# EAGLE design Noduino-Falcon (EAGLE 6.6.0)
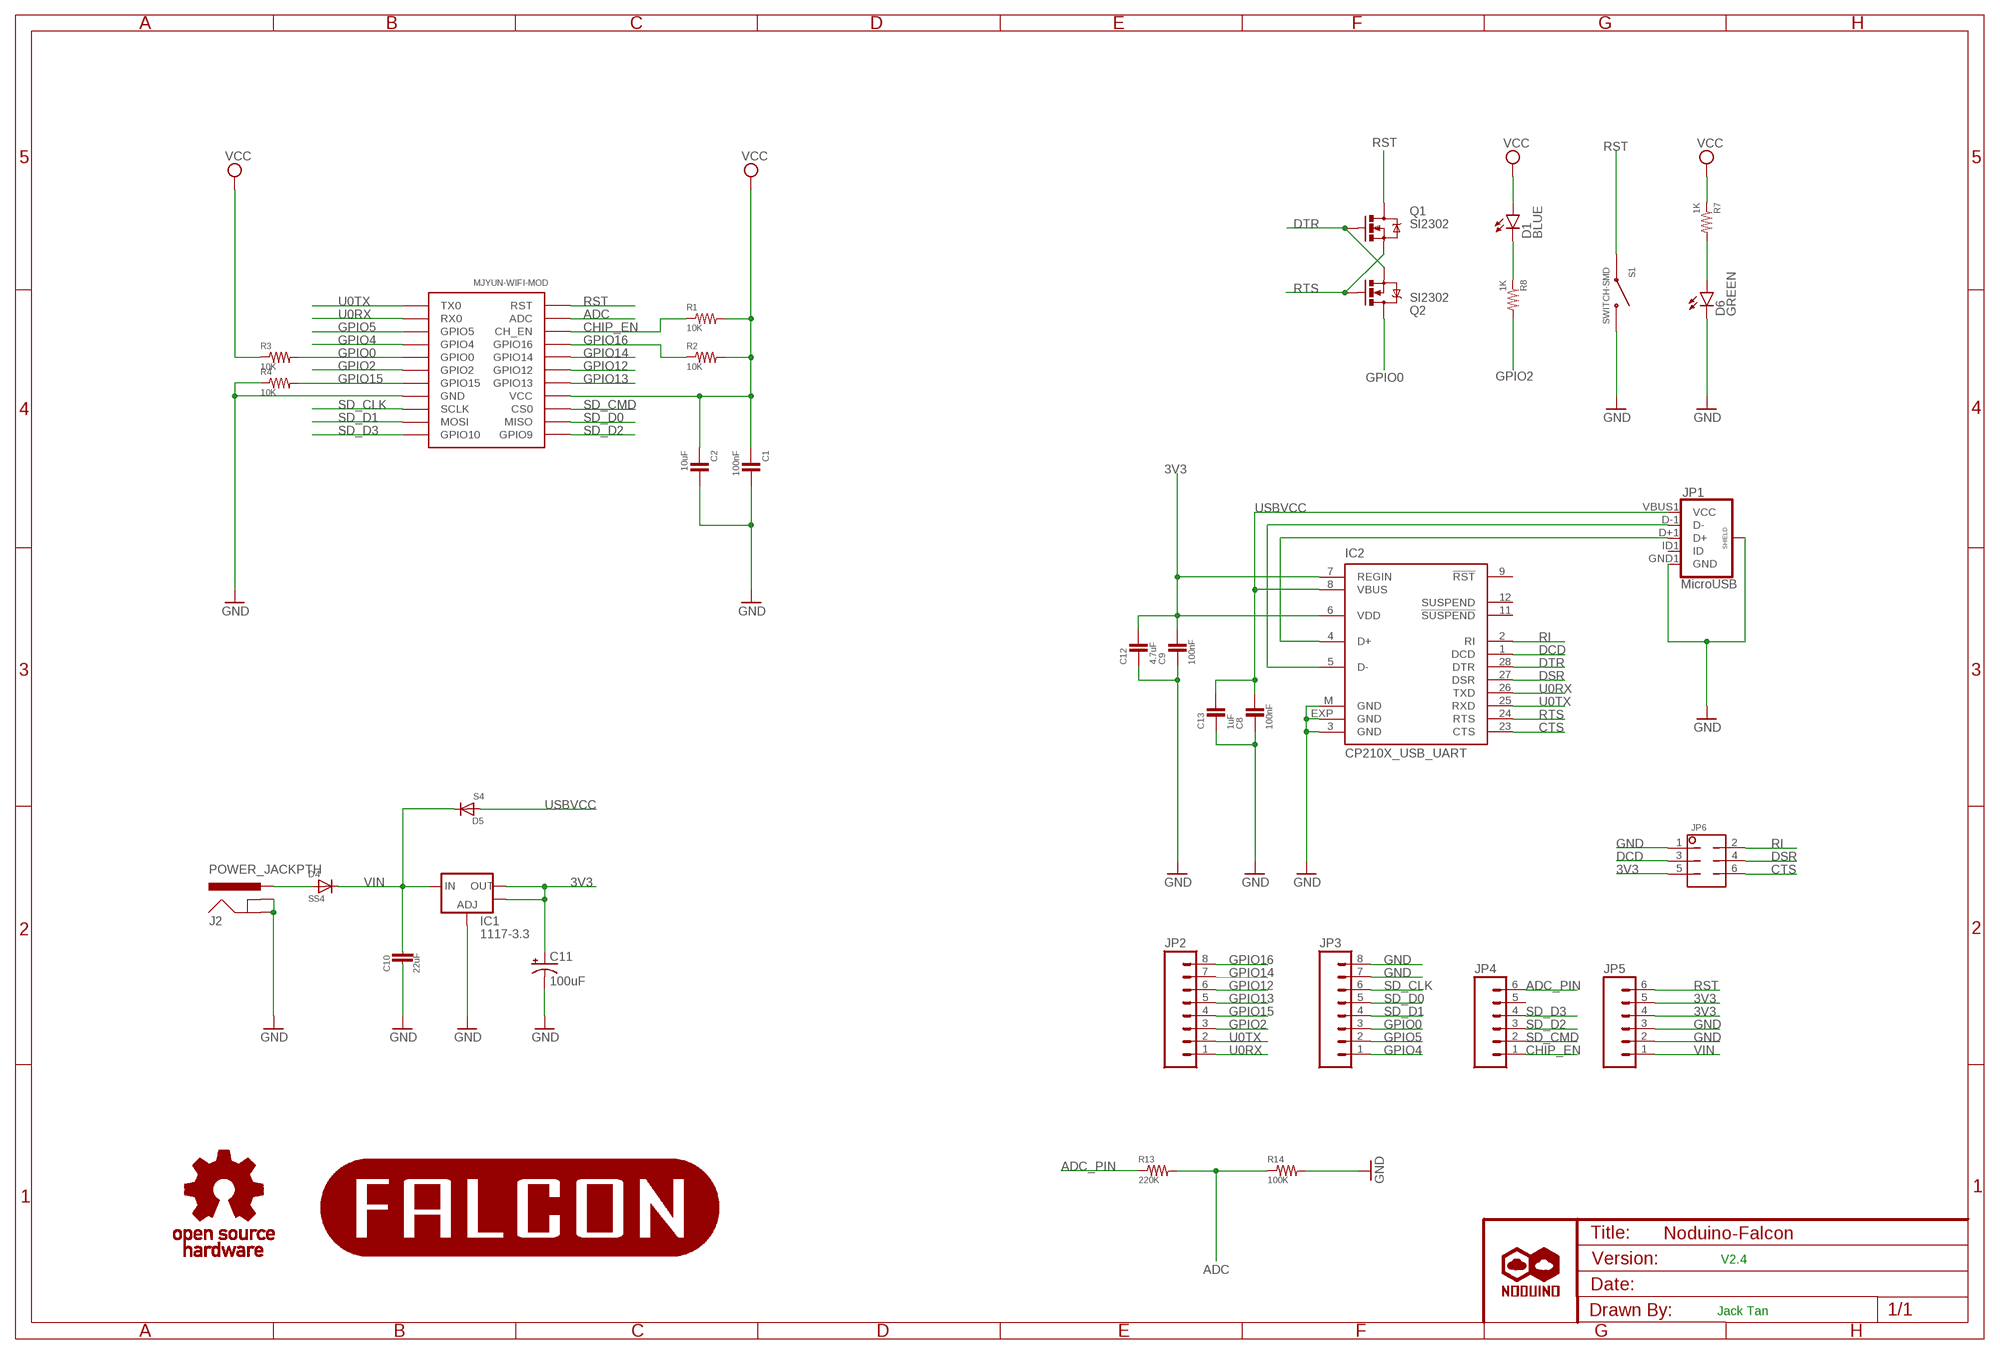
[diagram p0: schematic, sheet 1]

## Parts
C1  100nF  0603-CAP  [0603-CAP]
C2  10uF  0603-CAP  [0603-CAP]
C8  100nF  0603-CAP  [0603-CAP]
C9  100nF  0603-CAP  [0603-CAP]
C10  22uF  CAP-C1206  [C1206]
C11  100uF  CAP_POL3528  [EIA3528]
C12  4.7uF  0603-CAP  [0603-CAP]
C13  1uF  0603-CAP  [0603-CAP]
D1  BLUE  LED-GREEN0603  [LED-0603]
D4  SS4  DIODESMB  [SMB-DIODE]
D5  S4  DIODESOD  [SOD-323]
D6  GREEN  LED-GREEN0603  [LED-0603]
IC1  1117-3.3  AMS1117SOT223  [SOT223]
IC2  CP210X_USB_UART  [MLP28]
J2  POWER_JACKPTH  [POWER_JACK_PTH]
JP1  MicroUSB  USB_MICROB_PLUGCONN-11752  [USB-B-MICRO-SMD_V03]
JP2  M081X08  [1X08]
JP3  M081X08  [1X08]
JP4  M06SIP  [1X06]
JP5  M06SIP  [1X06]
JP6  M02X3  [2X3]
MJYUN-WIFI-MOD  ESP-1212F-DIP-SMD  [ESP-12F-DIP]
Q1  SI2302  -MOSFET-N-SMD  [SOT23-3]
Q2  SI2302  -MOSFET-N-SMD  [SOT23-3]
R1  10K  0603-RESISTOR  [0603-RES]
R2  10K  0603-RESISTOR  [0603-RES]
R3  10K  0603-RESISTOR  [0603-RES]
R4  10K  0603-RESISTOR  [0603-RES]
R7  1K  0603-RESISTOR  [0603-RES]
R8  1K  0603-RESISTOR  [0603-RES]
R13  220K  0603-RESISTOR  [0603-RES]
R14  100K  0603-RESISTOR  [0603-RES]
S1  SWITCH-SMD  [TACTILE-SWITCH-1101NE]
U$1  NODUINO-LOGO-ALL  [NODUINO-ALL-1]
U$2  NODUINO-FALCON  [NODUINO-FALCON]
U$3  OPEN_HARDWARE_LOGO  [OPEN_HARDWARE_LOGO]

## Nets
3V3: C1.1 C2.1 C9.2 C11.A(+) C12.2 D1.A IC1.2(OUT) IC1.4(OUT) IC2.6(VDD) IC2.7(REGIN) JP5.4 JP5.5 JP6.5 MJYUN-WIFI-MOD.P$8(VCC) MJYUN-WIFI-MOD.P$108(VCC) R1.2 R2.2 R3.1 R7.1 ; supply symbol labelled VCC
ADC: MJYUN-WIFI-MOD.P$2(ADC) MJYUN-WIFI-MOD.P$102(ADC) R13.2 R14.1
ADC_PIN: JP4.6 R13.1
CHIP_EN: JP4.1 MJYUN-WIFI-MOD.P$3(CH_EN) MJYUN-WIFI-MOD.P$103(CH_EN) R1.1
CTS: IC2.23(CTS) JP6.6
DCD: IC2.1(DCD) JP6.3
DSR: IC2.27(DSR) JP6.4
DTR: IC2.28(DTR) Q1.1(G) Q2.2(S)
GND: C1.2 C2.2 C8.1 C9.1 C10.2 C11.C(-) C12.1 C13.1 D6.C IC1.1(ADJ) IC2.3(GND) IC2.EXP(GND) IC2.M(GND) J2.GND J2.GNDBREAK JP1.GND1(GND) JP1.SHIELD1(SHIELD) JP1.SHIELD2(SHIELD) JP1.SHIELD3(SHIELD) JP3.7 JP3.8 JP5.2 JP5.3 JP6.1 MJYUN-WIFI-MOD.P$15(GND) MJYUN-WIFI-MOD.P$115(GND) R4.1 R14.2 S1.P$1
GPIO0: JP3.3 MJYUN-WIFI-MOD.P$18(GPIO0) MJYUN-WIFI-MOD.P$118(GPIO0) Q2.3(D) R3.2
GPIO2: JP2.3 MJYUN-WIFI-MOD.P$17(GPIO2) MJYUN-WIFI-MOD.P$117(GPIO2) R8.2
GPIO4: JP3.1 MJYUN-WIFI-MOD.P$19(GPIO4) MJYUN-WIFI-MOD.P$119(GPIO4)
GPIO5: JP3.2 MJYUN-WIFI-MOD.P$20(GPIO5) MJYUN-WIFI-MOD.P$120(GPIO5)
GPIO12: JP2.6 MJYUN-WIFI-MOD.P$6(GPIO12) MJYUN-WIFI-MOD.P$106(GPIO12)
GPIO13: JP2.5 MJYUN-WIFI-MOD.P$7(GPIO13) MJYUN-WIFI-MOD.P$107(GPIO13)
GPIO14: JP2.7 MJYUN-WIFI-MOD.P$5(GPIO14) MJYUN-WIFI-MOD.P$105(GPIO14)
GPIO15: JP2.4 MJYUN-WIFI-MOD.P$16(GPIO15) MJYUN-WIFI-MOD.P$116(GPIO15) R4.2
GPIO16: JP2.8 MJYUN-WIFI-MOD.P$4(GPIO16) MJYUN-WIFI-MOD.P$104(GPIO16) R2.1
N$1: D1.C R8.1
N$5: IC2.4(D+) JP1.D+1(D+)
N$9: IC2.5(D-) JP1.D-1(D-)
N$13: D6.A R7.2
N$16: D4.A J2.PWR
RI: IC2.2(RI) JP6.2
RST: JP5.6 MJYUN-WIFI-MOD.P$1(RST) MJYUN-WIFI-MOD.P$101(RST) Q1.3(D) S1.P$2
RTS: IC2.24(RTS) Q1.2(S) Q2.1(G)
SD_CLK: JP3.6 MJYUN-WIFI-MOD.P$14(SCLK)
SD_CMD: JP4.2 MJYUN-WIFI-MOD.P$9(CS0)
SD_D0: JP3.5 MJYUN-WIFI-MOD.P$10(MISO)
SD_D1: JP3.4 MJYUN-WIFI-MOD.P$13(MOSI)
SD_D2: JP4.3 MJYUN-WIFI-MOD.P$11(GPIO9)
SD_D3: JP4.4 MJYUN-WIFI-MOD.P$12(GPIO10)
U0RX: IC2.26(TXD) JP2.1 MJYUN-WIFI-MOD.P$21(RX0) MJYUN-WIFI-MOD.P$121(RX0)
U0TX: IC2.25(RXD) JP2.2 MJYUN-WIFI-MOD.P$22(TX0) MJYUN-WIFI-MOD.P$122(TX0)
USBVCC: C8.2 C13.2 D5.2(A) IC2.8(VBUS) JP1.VBUS1(VCC)
VIN: C10.1 D4.C D5.1(C) IC1.3(IN) JP5.1
Unconnected: IC2.9(!RST) IC2.11(!SUSPEND) IC2.12(SUSPEND) JP1.ID1(ID) JP4.5

## Notes on the sheet
- V2.4
- Jack Tan

## Library data of the parts
C1 C2 C8 C9 C12 C13 = ehl:0603-CAP
C10 = digital-toy:CAP: Capacitor Standard 0603 ceramic capacitor, and 0.1" leaded capacitor.
C11 = ehl:CAP_POL: Capacitor Polarized These are standard SMD and PTH capacitors. Normally 10uF, 47uF, and 100uF in electrolytic and tantalum varieties. Always verify the external diameter of the through hole cap, it varies with capacity, voltage, and manufacturer. The EIA devices should be standard.
D1 = SparkFun_ESP8266_Thing:LED-GREEN: Various green LEDs Green LEDs used in SFE Production 0603- DIO-00821 LARGE- DIO-00862 LILYPAD- DIO-09910; PROD_ID: DIO-00821; VALUE: GREEN
D4 D5 = ehl:DIODE: Diode These are standard reverse protection diodes and small signal diodes. SMA package can handle up to about 1A. SOD-323 can handle about 200mA. What the SOD-323 package when ordering, there are some mfgs out there that are 5-pin packages.
D6 = SparkFun_ESP8266_Thing:LED-GREEN: Various green LEDs Green LEDs used in SFE Production 0603- DIO-00821 LARGE- DIO-00862 LILYPAD- DIO-09910; PROD_ID: DIO-00821
IC1 = ehl:AMS1117: Voltage Regulator LM1117 Standard adjustable voltage regulator but in SMD form. Spark Fun Electronics SKU : COM-00595
IC2 = ehl:CP210X_USB_UART: Single-Chip USB to UART Bridge Source: www.silabs.com .. CP2101.pdf / cp2102.pdf. Spark Fun Electronics SKU : COM-00310
J2 = ehl:POWER_JACK: Power Jack This is the standard 5.5mm barrel jack for power. The PTH is the most common, proven, reliable, footprint. All others are experimental. The Slot footprint only works if the mill layer is transmitted to the PCB fab house so be warned. Spark Fun Electronics SKU : PRT-00119. Mating wall wart : TOL-00298 (and others)
JP1 = ehl:USB_MICROB_PLUG: USB Micro-B connectors Some male, some female. Watch your step!; PROD_ID: CONN-11752
JP2 JP3 = ehl:M08: Header 8 Standard 8-pin 0.1" header. Use with straight break away headers (SKU : PRT-00116), right angle break away headers (PRT-00553), swiss pins (PRT-00743), machine pins (PRT-00117), and female headers (PRT-00115).
JP4 JP5 = ehl:M06: Header 6 Standard 6-pin 0.1" header. Use with straight break away headers (SKU : PRT-00116), right angle break away headers (PRT-00553), swiss pins (PRT-00743), machine pins (PRT-00117), and female headers (PRT-00115). Molex polarized connector foot print use with SKU : PRT-08094 with associated crimp pins and housings. NOTES ON THE VARIANTS LOCK and LOCK_LONGPADS... This footprint was designed to help hold the alignment of a through-hole component (i.e. 6-pin header) while soldering it into place. You may notice that each hole has been shifted either up or down by 0.005 of an inch from it's more standard position (which is a perfectly straight line). This slight alteration caused the pins (the squares in the middle) to touch the edges of the holes. Because they are alternating, it causes a "brace" to hold the component in place. 0.005 has proven to be the perfect amount of "off-center" position when using our standard breakaway headers. Although looks a little odd when you look at the bare footprint, once you have a header in there, the alteration is very hard to notice. Also, if you push a header all the way into place, it is covered up entirely on the bottom side. This idea of altering the position of holes to aid alignment will be further integrated into the Sparkfun Library for other footprints. It can help hold any component with 3 or more connection pins.
JP6 = ehl:M02X3
MJYUN-WIFI-MOD = ehl:ESP-12
Q1 Q2 = digital-toy:*-MOSFET-N
R1-R4 R7 R8 R13 R14 = ehl:0603-RESISTOR
S1 = ehl:SWITCH-SMD
U$1 = ehl:NODUINO-LOGO-ALL
U$2 = ehl:NODUINO-FALCON
U$3 = ehl:OPEN_HARDWARE_LOGO

## Board
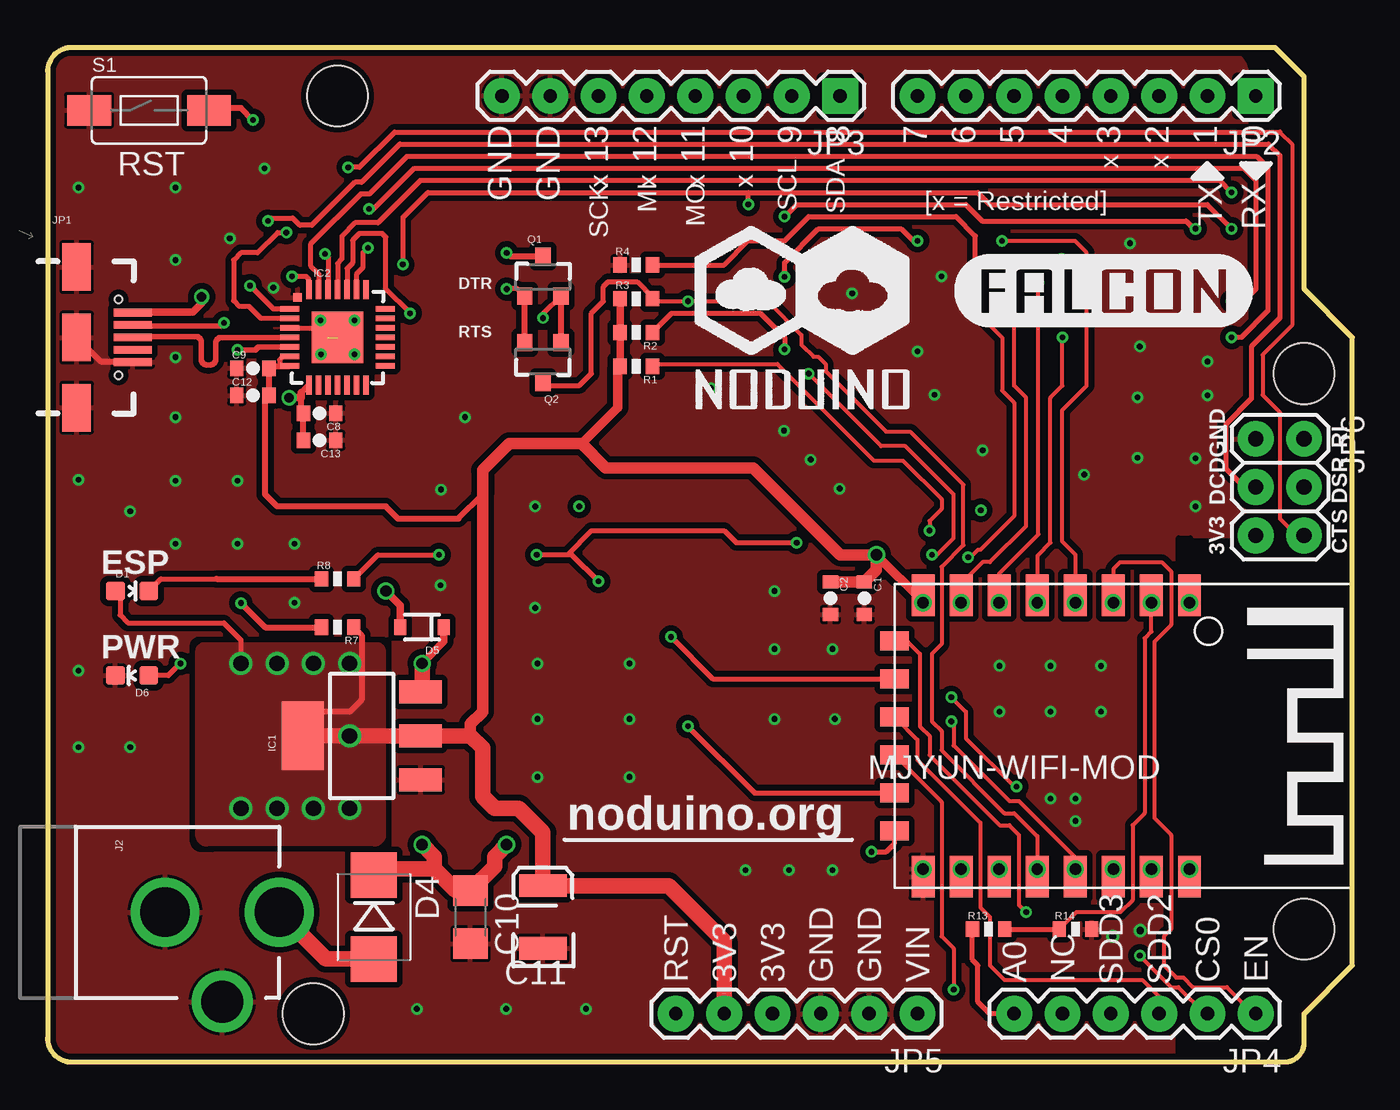
[diagram p1: board, top side]
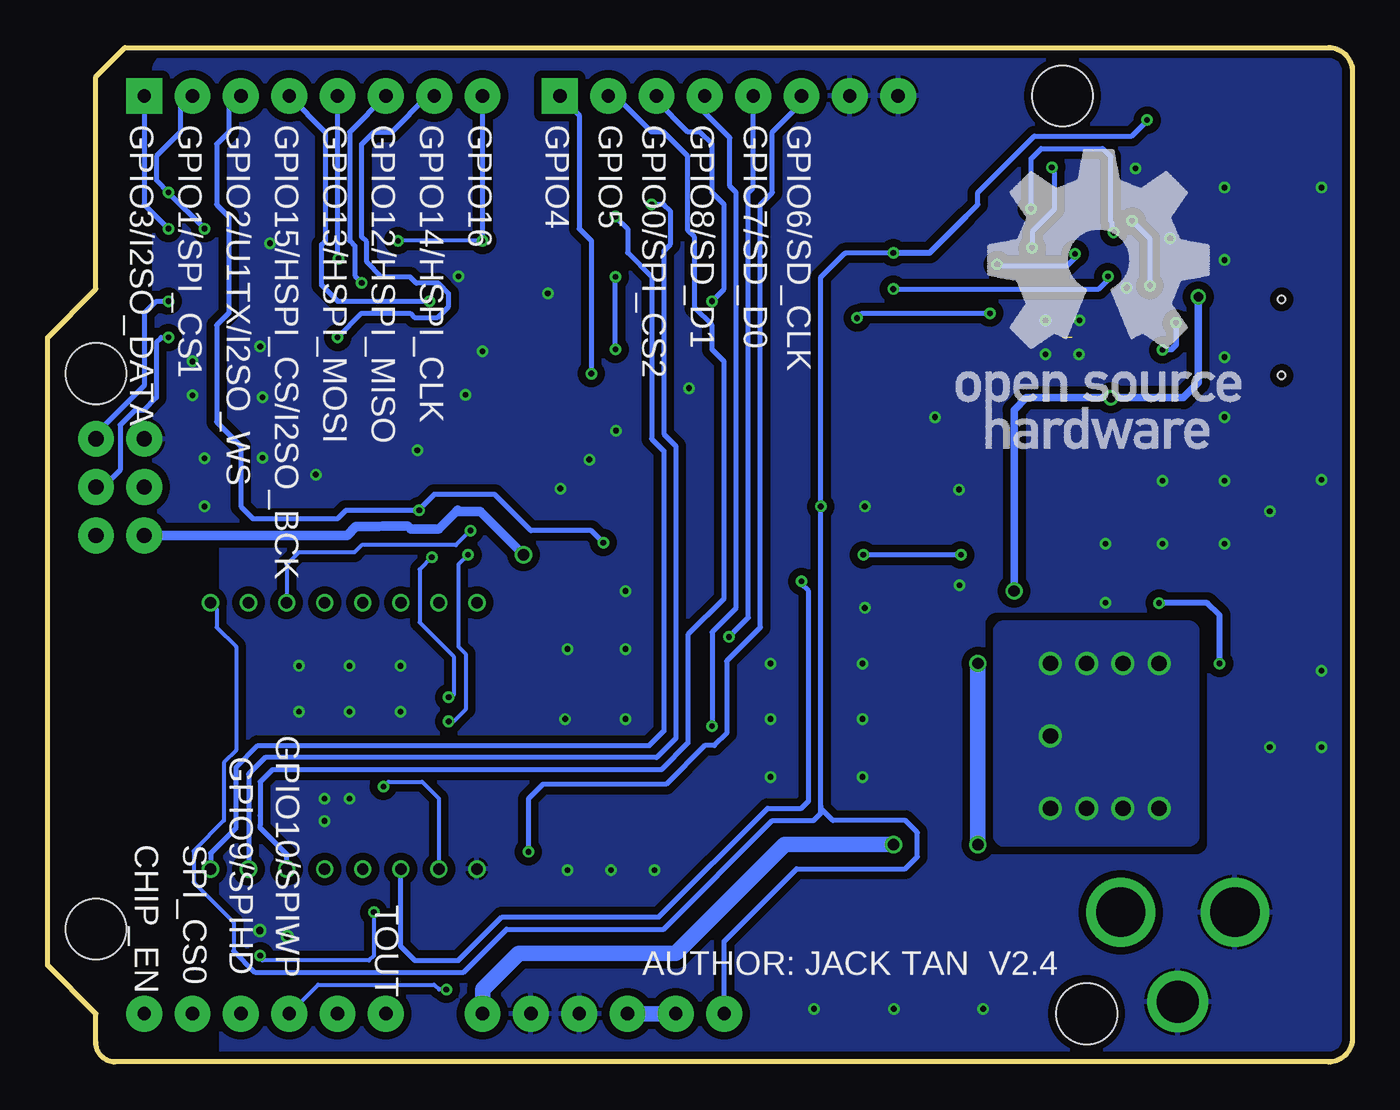
[diagram p2: board, bottom side, seen from below]

Size 68.58 x 53.34 mm. Coordinates in mm from the lower left corner, seen from the top.
Outline: 1.27,0 65.02,0 arc90 66.04,1.02 66.04,2.54 68.58,5.08 68.58,38.1 66.04,40.64 66.04,51.82 64.52,53.34 1.27,53.34 arc90 0,52.07 0,1.27 arc90 1.27,0
Copper layers (1*16): Top 0.035mm / dielectric 1.6mm / Bottom 0.035mm
Design rules "jackslab-micromod *": minimum track width 6mil, minimum drill 0.3mm, track to track 6mil, track to pad 6mil, pad to pad 6mil, via to via 6mil, smd to smd 6mil, copper to edge 6mil, drill to drill 6mil, minimum pad ring 6mil, minimum via ring 6mil, stop-mask expansion 4mil, vias tented up to drill 20mil, thermal gap 6mil
Holes 3.2 mm at 66.04,6.99 66.04,36.2 15.24,50.8 13.97,2.54

### Footprints (pad centres in the part's own frame; a part is rotated, then mirrored left to right if it is on the bottom)
0603-CAP = smd 0.7 x 0.8: 1 -0.85,0; 2 0.85,0
C1206 = smd 1.6 x 1.8: 1 -1.4,0; 2 1.4,0
EIA3528 = smd 1.2 x 2.5: A 1.65,0; C -1.65,0
LED-0603 = smd 1 x 1: A 0,-0.877; C 0,0.877
SMB-DIODE = smd 2.4 x 2.4: A 2.2,0; C -2.2,0
SOD-323 = smd 0.63 x 0.83: 1 -1.15,0; 2 1.15,0
SOT223 = smd 1.219 x 2.235: 1 -2.311,-3.099; 2 0,-3.099; 3 2.311,-3.099 | smd 3.6 x 2.2: 4 0,3.099
MLP28 = smd 1 x 0.3: 1 -2.5,1.5; 2 -2.5,1; 3 -2.5,0.5; 4 -2.5,0; 5 -2.5,-0.5; 6 -2.5,-1; 7 -2.5,-1.5; 15 2.5,-1.5; 16 2.5,-1; 17 2.5,-0.5; 18 2.5,0; 19 2.5,0.5; 20 2.5,1; 21 2.5,1.5 | smd 0.3 x 1: 8 -1.5,-2.5; 9 -1,-2.5; 10 -0.5,-2.5; 11 0,-2.5; 12 0.5,-2.5; 13 1,-2.5; 14 1.5,-2.5; 22 1.5,2.5; 23 1,2.5; 24 0.5,2.5; 25 0,2.5; 26 -0.5,2.5; 27 -1,2.5; 28 -1.5,2.5 | smd 2.7 x 2.7: EXP 0,0 | smd 0.435 x 0.435: M -2.103,2.103
POWER_JACK_PTH = drill 2.6: GND 0,7.7; PWR 0,13.7 | drill 2.2: GNDBREAK 4.7,10.7
USB-B-MICRO-SMD_V03 = smd 2 x 0.4: D+1 2.954,0; D-1 2.954,0.65; GND1 2.954,-1.3; ID1 2.954,-0.65; VBUS1 2.954,1.3 | smd 1.5 x 2.5: SHIELD1 0,3.7; SHIELD2 0,-3.7; SHIELD3 0,0 | hole 0.4: 2.2,2; 2.2,-2
1X08 = drill 0.7 pad 1.88 square: 1 0,0 | drill 0.7 pad 1.88: 2 2.54,0; 3 5.08,0; 4 7.62,0; 5 10.16,0; 6 12.7,0; 7 15.24,0; 8 17.78,0
1X06 = drill 0.7 pad 1.88: 1 0,0; 2 2.54,0; 3 5.08,0; 4 7.62,0; 5 10.16,0; 6 12.7,0
2X3 = drill 0.8 pad 1.88: 1 0,0; 2 0,2.54; 3 2.54,0; 4 2.54,2.54; 5 5.08,0; 6 5.08,2.54
ESP-12F-DIP = drill 0.6: P$1 -3.5,-7; P$2 -1.5,-7; P$3 0.5,-7; P$4 2.5,-7; P$5 4.5,-7; P$6 6.5,-7; P$7 8.5,-7; P$8 10.5,-7; P$15 10.5,7; P$16 8.5,7; P$17 6.5,7; P$18 4.5,7; P$19 2.5,7; P$20 0.5,7; P$21 -1.5,7; P$22 -3.5,7 | smd 1.5 x 1: P$9 12,-5; P$10 12,-3; P$11 12,-1; P$12 12,1; P$13 12,3; P$14 12,5 | smd 1.2 x 2.2: P$101 -3.5,-7.4; P$102 -1.5,-7.4; P$103 0.5,-7.4; P$104 2.5,-7.4; P$105 4.5,-7.4; P$106 6.5,-7.4; P$107 8.5,-7.4; P$108 10.5,-7.4; P$115 10.5,7.4; P$116 8.5,7.4; P$117 6.5,7.4; P$118 4.5,7.4; P$119 2.5,7.4; P$120 0.5,7.4; P$121 -1.5,7.4; P$122 -3.5,7.4
SOT23-3 = smd 0.8 x 0.9: 1 -0.95,-1; 2 0.95,-1; 3 0,1.1
0603-RES = smd 0.7 x 0.8: 1 -0.85,0; 2 0.85,0
TACTILE-SWITCH-1101NE = smd 2.3 x 1.6: P$1 -3.15,0; P$2 3.15,0

### Placement (x,y rotation side)
C1  42.93,24.38 270 top
C2  41.15,24.38 270 top
C8  14.3,34.11 180 top
C9  10.79,36.47 0 top
C10  22.23,7.62 270 top
C11  26.04,7.62 90 top
C12  10.79,35.05 0 top
C13  14.3,32.69 180 top
D1  4.45,24.77 270 top
D4  17.14,7.62 270 top
D5  19.68,22.86 180 top
D6  4.45,20.32 90 top
IC1  16.51,17.14 90 top
IC2  15.24,38.1 0 top
J2  -1.52,7.87 270 top
JP1  1.52,38.1 0 top
JP2  63.5,50.8 180 top
JP3  41.66,50.8 180 top
JP4  63.5,2.54 180 top
JP5  45.72,2.54 180 top
JP6  63.5,32.77 270 top
MJYUN-WIFI-MOD  56.52,17.14 180 top
Q1  26.04,41.27 0 top
Q2  26.04,36.83 180 top
R1  30.94,36.58 180 top
R2  30.94,38.35 180 top
R3  30.94,40.13 0 top
R4  30.94,41.91 0 top
R7  15.24,22.86 180 top
R8  15.24,25.4 0 top
R13  49.45,6.99 0 top
R14  54.03,6.99 0 top
S1  5.33,50.04 0 top
U$1  33.66,33.66 0 top
U$2  47.68,38.64 0 top
U$3  20.82,32.24 0 bottom

### Tracks (layer width: path | path; a pad name or v marks a point on that pad's centre or on a via)
3V3  (via drill 0.6, 0.81)
  Top 0.203: MJYUN-WIFI-MOD.P$8 MJYUN-WIFI-MOD.P$108 | D1.A 3.81,24.52 | 11.43,35.18 11.63,35.38 C12.2
  Top 0.254: 16.51,22.44 R7.1 | 12.19,36.6 IC2.7 | IC2.6 12.37,37.11 12.19,36.93 12.19,36.6 | 3.81,24.52 3.81,23.5 4.22,23.09 9.27,23.09 10.16,22.2 v10.16,20.95 | 12.19,36.58 12.19,36.6
  Top 0.305: IC1.4 13.41,17.22 13.97,17.78 13.34,17.78 13.34,18.41 15.88,18.41 16.51,19.05 16.51,22.44 | 22.86,29.84 21.59,28.57 18.41,28.57 17.78,29.21 12.06,29.21 11.43,29.84 11.43,35.18 | C12.2 C9.2 11.77,36.6 IC2.7
  Top 0.406: R1.2 R2.2 R3.1
  Top 0.508: R1.2 30.1,36.56 29.97,36.44 29.97,34.42 28.07,32.51 | v43.56,26.67 46.02,24.22 MJYUN-WIFI-MOD.P$8
  Top 0.61: 22.23,17.14 22.23,17.78 22.86,18.41 22.86,29.84 22.86,31.11 24.26,32.51 28.07,32.51 29.34,31.24 37.08,31.24 41.66,26.67 v43.56,26.67 43.56,25.87 C1.1 C2.1
  Top 0.813: JP5.5 35.56,6.35 32.64,9.27 C11.A 26.04,12.06 24.77,13.34 23.5,13.34 22.86,13.97 22.86,16.51 22.23,17.14 IC1.2 IC1.4
  Bottom 0.203: 51.16,28.17 51.18,28.14
  Bottom 0.406: 51.16,28.17 50.98,28.19
  Bottom 0.508: 50.98,28.19 49.66,28.19 49.48,28.02 48.03,28.02 47.1,28.94 | 47.1,28.94 47.02,29.03 | 51.18,28.14 52.38,28.14 52.83,27.69 JP6.5 | v43.56,26.67 45.83,28.94 47.1,28.94
  Bottom 0.813: JP5.5 JP5.4
  other vias: 12.06,20.95 13.97,20.95 15.88,20.95 10.16,13.34 12.06,13.34 13.97,13.34 15.88,13.34 15.88,17.14
  pour Bottom (no thermals): 8.13,12.7 8.13,22.61 arc-90 8.64,23.11 17.53,23.11 18.03,23.11 18.29,23.11 arc-90 18.8,22.61 18.8,18.29 18.8,12.19 18.8,11.94 arc-90 18.29,11.43 8.64,11.43 arc-90 8.13,11.94
  pour Top (no thermals): 7.87,12.7 7.87,21.59 arc-90 8.26,21.97 17.14,21.97 17.3,21.97 arc-90 17.68,21.59 17.68,18.82 17.68,15.39 17.68,14.43 17.68,12.83 17.68,11.96 arc-90 17.14,11.43 8.38,11.43 arc-90 7.87,11.94
ADC
  Top 0.203: R14.1 54.06,7.87 56.39,7.87 57.02,8.51 57.02,12.45 57.66,13.08 57.66,22.27 58.02,22.63 MJYUN-WIFI-MOD.P$2 MJYUN-WIFI-MOD.P$102
  Top 0.254: R13.2 R14.1
ADC_PIN
  Top 0.254: JP4.6 49.53,2.54 48.9,3.17 48.9,5.08 48.6,5.38 R13.1
CHIP_EN  (via drill 0.3)
  Top 0.203: MJYUN-WIFI-MOD.P$3 MJYUN-WIFI-MOD.P$103 56.02,25.92 56.39,26.29 58.55,26.29 59.05,25.78 59.05,22.99 58.17,22.1 58.17,12.83 59.05,11.94 59.05,6.99 58.67,6.6 58.67,5.08 59.31,4.45 59.69,4.45 60.2,3.94 61.98,3.94 63.37,2.54 JP4.1 | R1.1 31.91,36.7 38.35,36.7 43.43,31.62 44.96,31.62 46.99,29.59 46.99,29.08 46.35,28.45 v46.35,27.94
  Bottom 0.203: v46.35,27.94 47.12,27.18 52.07,27.18 52.45,26.8 55.37,26.8 56.02,26.15 MJYUN-WIFI-MOD.P$3
CTS  (via drill 0.3)
  Top 0.203: 64.77,48.9 65.41,48.26 65.41,38.73 63.86,37.19 63.86,35.08 64.77,34.16 64.77,28.57 65.66,27.69
  Top 0.254: 64.77,48.9 18.24,48.9 16.38,47.04 v15.8,47.04 | 65.66,27.69 JP6.6 | IC2.23 16.26,40.62 16.26,41.45 16.59,41.78 16.59,42.57 16.82,42.8 v16.84,42.8
  Bottom 0.254: v16.84,42.8 16.79,42.85 16.79,43.69 15.67,44.81 15.67,46.79 v15.8,47.04
DCD  (via drill 0.3)
  Top 0.254: JP6.3 62.89,30.23 61.92,31.19 61.92,33.53 63.27,34.87 63.27,37.62 64.77,39.12 64.77,47.68 64.16,48.26 18.52,48.26 16.51,46.25 16.15,46.25 13.89,43.99 13.26,43.99 12.88,44.37 11.71,44.37 11.58,44.25 v11.58,44.22 | v10.64,40.82 11.86,39.6 IC2.1
  Bottom 0.254: v11.58,44.22 10.64,43.28 v10.64,40.82
DSR  (via drill 0.3)
  Top 0.254: v62.23,38.1 62.74,38.1 64.14,39.5 64.14,47.04 63.55,47.62 18.9,47.62 16.92,45.64 16.46,45.64 13.82,43 13.82,41.88 14.24,41.46 IC2.27
  Bottom 0.254: JP6.4 65.66,30.23 64.77,31.11 64.77,33.5 63.98,34.29 63.5,34.29 62.87,34.92 62.87,37.85 62.61,38.1 v62.23,38.1
DTR  (via drill 0.3)
  Top 0.254: Q1.1 25.07,40.26 24.66,40.66 24.16,40.66 v24.13,40.64 | IC2.28 13.72,40.62 13.72,41.17 13.59,41.3 v12.85,41.3
  Top 0.305: Q2.2 Q1.1
  Bottom 0.254: v24.13,40.64 13.34,40.64 12.85,41.12 v12.85,41.3
GND  (via drill 0.3, 0.38)  (1 unrouted)
  Top 0.254: 14.25,38.58 12.76,38.58 IC2.3
  Top 0.305: JP1.SHIELD3 2.79,36.83 3.81,36.83 3.84,36.8 JP1.GND1 | 14.25,38.58 14.73,38.1 v14.38,37.21
  other vias: 56.9,43.05 60.33,29.21 60.33,31.75 60.96,35.05 60.96,36.83 46.99,41.3 6.73,42.16 6.73,33.91 6.73,37.06 11.4,46.99 12.98,27.25 6.73,27.25 12.98,24.16 20.65,25.07 9.58,43.31 1.63,45.97 6.73,45.97 34.87,35.43 11.86,40.72 50.04,20.83 52.7,20.83 55.37,20.83 50.04,18.41 52.7,18.41 55.37,18.41 52.7,13.84 54.03,12.67 21.95,33.91 20.68,30.1 25.63,29.21 25.63,23.88 25.76,20.95 25.76,18.03 25.76,14.99 28.3,2.79 24.1,2.79 19.41,2.79 1.63,16.56 1.63,20.57 1.63,30.61 4.34,28.96 4.34,16.56 38.2,24.77 38.2,18.03 41.38,18.03 41.25,21.72 38.2,21.72 38.71,33.2 40.11,31.67 41.63,30.15 30.58,20.95 30.58,18.03 30.58,14.99 36.68,10.08 38.96,10.08 41.25,10.08 42.29,40.41 45.72,37.36 46.61,35.08 49.15,32.16 57.4,37.62 57.28,34.95 57.28,31.78 54.48,30.89 57.43,6.91 55.98,6.6 16.13,37.21 16.13,38.99 14.35,38.99 54.03,13.84 9.98,27.25 9.98,30.56 6.73,30.56
  pour Top (isolate 0.406, rank 2): 0.25,51.82 0.25,52.07 arc-90 1.27,53.09 61.98,53.09 arc-90 62.99,52.07 62.99,1.27 arc-90 61.98,0.25 1.27,0.25 arc-90 0.25,1.27
  pour Top (isolate 0.305, rank 2): 0.25,44.7 0.25,52.07 arc-90 1.27,53.09 61.98,53.09 arc-90 62.99,52.07 62.99,1.27 arc-90 61.98,0.25 1.27,0.25 arc-90 0.25,1.27
  pour Bottom (isolate 0.406, rank 2): 61.98,53.09 arc-90 62.99,52.07 62.99,49.28 62.99,1.27 arc-90 61.98,0.25 61.47,0.25 0,0.25 arc-90 -1.02,1.27 -1.02,15.49 -1.02,46.99 -1.02,52.58 arc-90 -0.25,53.09
GPIO0  (via drill 0.3)
  Top 0.203: MJYUN-WIFI-MOD.P$118 MJYUN-WIFI-MOD.P$18 52.02,11.87 50.8,13.08 50.29,13.08 46.99,16.38 46.99,17.4 46.48,17.91 46.48,21.46 46.99,21.97 46.99,26.04 48.13,27.18 48.13,30.35 45.34,33.15 44.07,33.15 40.89,36.32 40.89,36.7 40.51,37.08 40.26,37.08 39.62,37.72 39.62,38.23 37.85,40.01 v33.66,40.01 32,40.01 31.79,40.22
  Top 0.254: Q2.3 26.2,35.56 27.94,35.56 28.57,36.2 28.57,39.37 29.21,40.01 29.21,40.77 29.46,41.02 30.99,41.02 31.79,40.22 R3.2
  Bottom 0.254: v33.66,40.01 33.02,40.64 33.02,45.09 33.66,45.72 33.66,48.26 34.29,48.9 34.92,48.9 36.58,50.55 JP3.3
GPIO2  (via drill 0.3)
  Top 0.203: 49.05,28.96 v49.05,29.01 | MJYUN-WIFI-MOD.P$117 MJYUN-WIFI-MOD.P$17
  Top 0.254: R8.2 17.36,26.67 v20.57,26.67 | v39.37,27.3 36.2,27.3 35.56,27.94 28.57,27.94 27.3,26.67 | 27.3,26.67 v25.7,26.67 | v28.96,25.27 27.56,26.67 27.3,26.67
  Bottom 0.254: v39.37,27.3 40.01,27.94 43.18,27.94 45.09,29.84 48.26,29.84 49.02,29.08 v49.05,29.01 52.91,29.01 53.34,28.57 57.78,28.57 58.42,29.21 58.42,32.38 59.69,33.66 59.69,38.73 59.05,39.37 59.05,44.45 59.69,45.09 59.69,48.26 59.05,48.9 59.05,50.16 JP2.3 | v20.57,26.67 v25.7,26.67 | MJYUN-WIFI-MOD.P$17 50.04,10.12 50.04,6.1 49.28,5.33 46.99,5.33 44.7,7.62 36.45,7.62 30.73,13.34 28.96,13.34 28.57,13.72 28.57,24.77 28.96,25.15 v28.96,25.27
GPIO4  (via drill 0.3)
  Top 0.203: v40.01,36.2 43.81,32.38 45.09,32.38 47.62,29.84 47.62,27.56 46.74,26.67 v46.48,26.67 | MJYUN-WIFI-MOD.P$119 MJYUN-WIFI-MOD.P$19 54.02,10.76 51.05,13.72 50.55,13.72 47.62,16.64 47.62,17.78 v47.5,17.91
  Bottom 0.203: v46.48,26.67 46.99,26.16 46.99,21.84 46.61,21.46 46.61,18.54 47.24,17.91 v47.5,17.91
  Bottom 0.254: JP3.1 40.64,49.78 40.64,43.81 40.01,43.18 v40.01,36.2
GPIO5
  Top 0.203: MJYUN-WIFI-MOD.P$20 MJYUN-WIFI-MOD.P$120
  Bottom 0.254: JP3.2 38.73,50.8 36.83,48.9 36.2,48.9 34.92,47.62 34.92,43.71 34.57,43.36 34.57,39.65 33.66,38.73 33.66,37.47 33.02,36.83 33.02,24.38 34.92,22.48 34.92,16.76 36.32,15.37 56.77,15.37 57.4,14.73 57.4,12.95 57.4,12.45 57.4,12.32 56.01,10.92 56.01,10.15 MJYUN-WIFI-MOD.P$20
GPIO12  (via drill 0.3)
  Top 0.203: v52.07,40.97 52.07,27.74 50.02,25.68 MJYUN-WIFI-MOD.P$106 MJYUN-WIFI-MOD.P$6
  Bottom 0.254: JP2.6 52.7,48.9 52.7,43.18 52.43,42.9 52.43,41.35 52.07,41 v52.07,40.97
GPIO13  (via drill 0.3)
  Top 0.203: v53.29,42.24 51.13,42.24 50.8,41.91 50.8,35.56 51.44,34.92 51.44,28.19 49.53,26.29 49.15,26.29 48.02,25.16 MJYUN-WIFI-MOD.P$107 MJYUN-WIFI-MOD.P$7
  Bottom 0.203: v53.29,42.24 53.34,42.29
  Bottom 0.254: 53.34,42.29 JP2.5
GPIO14  (via drill 0.3)
  Top 0.203: v53.34,38.1 53.34,35.56 52.7,34.92 52.7,27.3 52.02,26.61 MJYUN-WIFI-MOD.P$105 MJYUN-WIFI-MOD.P$5
  Bottom 0.254: v53.34,38.1 52.07,39.37 49.53,39.37 49.3,39.14 48.08,39.14 47.5,39.73 47.5,40.41 48.03,40.95 49.2,40.95 49.53,41.27 51,41.27 51.82,42.09 51.82,43.13 52.07,43.38 52.07,48.26 51.44,48.9 50.49,48.9 48.59,50.8 JP2.7
GPIO15  (via drill 0.3)
  Top 0.203: v48.51,40.01 48.51,39.75 50.16,38.1 50.16,35.31 50.8,34.67 50.8,28.7 49.02,26.92 48.9,26.92 48.51,26.54 v48.39,26.54 | MJYUN-WIFI-MOD.P$16 MJYUN-WIFI-MOD.P$116 | v47.5,19.18 48.26,18.41 48.26,17.02 50.8,14.48 v50.93,14.48
  Top 0.254: R4.2 35.56,41.91 36.83,43.18 38.73,43.18 40.01,44.45 47.75,44.45 48.77,43.43 48.77,40.26 v48.51,40.01
  Bottom 0.203: v48.39,26.54 49.02,25.91 49.02,23.11 47.24,21.34 47.24,19.3 47.37,19.18 v47.5,19.18 | v50.93,14.48 50.67,14.73 48.9,14.73 48.02,13.85 MJYUN-WIFI-MOD.P$16
  Bottom 0.254: v48.51,40.01 53.34,40.01 54.18,40.84 54.18,42.98 53.98,43.18 53.98,48.9 JP2.4
GPIO16  (via drill 0.3)
  Top 0.203: v50.16,43.18 53.98,43.18 54.61,42.55 54.61,35.56 53.34,34.29 53.34,27.36 54.02,26.68 MJYUN-WIFI-MOD.P$104 MJYUN-WIFI-MOD.P$4
  Top 0.254: v38.73,37.47 38.73,38.1 37.47,39.37 32.8,39.37 R2.1 | v38.73,41.27 38.73,42.04 40.51,43.81 44.86,43.81 45.49,43.18 v45.72,43.18
  Bottom 0.203: v45.72,43.18 v50.16,43.18
  Bottom 0.254: v45.72,43.18 JP2.8 | v38.73,37.47 v38.73,41.27
N$1
  Top 0.254: D1.C 5.96,25.4 8.89,25.4
  Top 0.305: 8.89,25.4 R8.1
N$2
  cutout Bottom: 59.69,27.56 65.15,27.56 65.15,-0.76 59.69,-0.76 59.69,27.69
N$3
  cutout Top: 59.82,27.43 64.9,27.43 64.9,-0.33 59.44,-0.33 59.44,27.56 60.07,27.56 60.07,27.43
N$4
  cutout Top: 13.34,40.01 17.14,40.01 17.14,36.2 13.34,36.2
N$5
  Top 0.203: JP1.D+1 4.58,38.2 4.61,38.18
  Top 0.254: 4.61,38.18 4.64,38.15 arc45 4.74,38.1 arc-90 4.79,38.15
  Top 0.279: 4.79,38.15 7.77,38.15 arc-90 8.08,37.85 8.08,36.96 arc90 8.38,36.65 8.53,36.65 arc90 8.84,36.96 8.84,37.8 arc-90 9.14,38.1 IC2.4
N$9  (via drill 0.3)
  Top 0.203: 4.24,38.73 4.34,38.68
  Top 0.279: 4.34,38.68 9.09,38.68 v9.27,38.86 | IC2.5 11.08,37.6 10.92,37.44 v9.98,37.44
  Top 0.305: JP1.D-1 4.24,38.73
  Bottom 0.254: v9.98,37.44 10.06,37.44 10.03,37.47
  Bottom 0.279: 10.03,37.47 9.53,37.47 9.27,37.72 v9.27,38.86
N$13  (via drill 0.3)
  Top 0.254: v6.99,20.95 6.35,20.32 D6.A
  Top 0.305: v10.16,24.13 11.43,22.86 R7.2
  Bottom 0.305: v6.99,20.95 6.99,23.5 7.62,24.13 v10.16,24.13
N$16
  Top 0.813: J2.PWR 14.63,5.42 D4.A
RI  (via drill 0.3)
  Top 0.254: v62.23,40.01 62.87,40.01 63.5,40.64 63.5,46.35 62.87,46.99 19.28,46.99 17.14,44.86 v16.89,44.86 | IC2.2 11.23,39.09 10.59,39.73 10.08,39.73 9.78,40.03 9.78,42.16 10.16,42.55 11.02,42.55 12.09,43.61 v12.55,43.61
  Bottom 0.254: JP6.2 66.04,33.02 63.5,35.56 63.5,39.37 62.87,40.01 v62.23,40.01 | v16.89,44.86 16.84,44.91 16.89,44.96 16.89,47.5 16.36,48.03 13.13,48.03 12.7,47.6 12.7,44.2 12.62,44.12 12.62,43.69 v12.55,43.61
RST  (via drill 0.3)
  Top 0.254: MJYUN-WIFI-MOD.P$1 MJYUN-WIFI-MOD.P$101
  Top 0.305: 26.2,42.55 Q1.3 24.3,42.38 v24.13,42.55 | S1.P$2 8.61,50.16 10.16,50.16 v10.79,49.53
  Bottom 0.203: MJYUN-WIFI-MOD.P$1 59.69,23.82 59.69,22.86 58.67,21.84 58.67,16.38 59.31,15.75 59.31,12.7 60.91,11.1 60.91,9.45 58.8,7.34 58.8,5.84
  Bottom 0.254: JP5.6 33.02,6.35 29.21,10.16 23.5,10.16 22.86,10.79 22.86,12.06 23.5,12.7 27.3,12.7 27.87,13.26 arc45 27.94,13.44 | 27.94,13.44 v27.94,29.21 27.94,41.27 26.74,42.47 arc45 26.57,42.55 23.5,42.55 | 20.32,44.45 19.68,45.09 19.68,45.72 16.71,48.69 11.61,48.69 10.79,49.51 v10.79,49.53 | 27.94,13.44 27.94,13.08 28.32,12.7 30.48,12.7 36.2,6.99 44.45,6.99 46.74,4.7 57.66,4.7 58.8,5.84
  Bottom 0.305: 20.32,44.45 22.23,42.55 23.5,42.55 v24.13,42.55
RTS  (via drill 0.3)
  Top 0.254: Q1.2 26.04,39.33 v26.04,39.12 | v19.05,39.37 17.78,40.64 17.78,43.38 17.6,43.56 16.38,43.56 16.03,43.2 16.03,42.01 15.74,41.72 IC2.24
  Top 0.305: Q2.1 Q1.2
  Bottom 0.254: v26.04,39.12 25.78,39.37 v19.05,39.37
SD_CLK  (via drill 0.3)
  Top 0.254: v43.31,11.05 44.07,11.05 44.52,11.49 MJYUN-WIFI-MOD.P$14
  Bottom 0.254: JP3.6 28.96,50.42 30.48,48.9 30.48,45.72 31.11,45.09 31.11,22.86 32.89,21.08 32.89,17.27 33.53,16.64 34.04,16.64 36.07,14.61 42.55,14.61 43.31,13.84 v43.31,11.05
SD_CMD  (via drill 0.3)
  Top 0.203: MJYUN-WIFI-MOD.P$9 44.56,22.1 45.21,22.1 45.85,21.46 45.85,17.65 46.35,17.14 46.35,16.13 50.04,12.45 50.55,12.45 51.05,11.94 51.05,8.26 v51.44,7.87 | v57.4,5.59 59.05,3.94 59.44,3.94 60.83,2.54 JP4.2
  Bottom 0.203: v51.44,7.87 51.44,5.59 51.69,5.33 57.28,5.33 57.4,5.46 v57.4,5.59
SD_D0  (via drill 0.3)
  Top 0.254: v32.77,22.35 34.97,20.14 MJYUN-WIFI-MOD.P$10
  Bottom 0.203: 31.5,50.55 JP3.5
  Bottom 0.254: JP3.5 31.5,45.97 31.75,45.72 31.75,23.37 v32.77,22.35
SD_D1  (via drill 0.3)
  Top 0.254: v33.66,17.65 37.16,14.14 MJYUN-WIFI-MOD.P$13
  Bottom 0.254: JP3.4 34.04,49.91 32.72,48.59 32.72,46.05 32.38,45.72 32.38,23.88 33.66,22.61 v33.66,17.65
SD_D2
  Top 0.203: MJYUN-WIFI-MOD.P$11 45.72,16.94 45.72,15.88 49.02,12.57 49.02,11.81 49.02,11.3 49.02,8.13 49.53,7.62 49.53,5.08 50.29,4.32 57.53,4.32 58.42,3.43 JP4.3
SD_D3  (via drill 0.3)
  Top 0.203: MJYUN-WIFI-MOD.P$12 46.99,13.67 46.99,6.6 47.62,5.97 v47.62,3.81
  Bottom 0.203: JP4.4 54.36,4.06 48.26,4.06 48.01,3.81 v47.62,3.81
U0RX  (via drill 0.3)
  Top 0.203: MJYUN-WIFI-MOD.P$21 MJYUN-WIFI-MOD.P$121
  Top 0.254: 36.83,45.72 19.99,45.72 18.67,44.4 v18.67,41.94 | 36.83,45.72 48.9,45.72 49.53,45.09 60.96,45.09 v62.23,43.81 | v36.83,45.09 36.83,45.72 | v14.58,42.49 14.74,42.33 IC2.26
  Bottom 0.254: JP2.1 63.5,45.09 v62.23,43.81 | v36.83,45.09 36.2,45.09 35.87,44.76 35.87,42.98 36.2,42.65 36.2,33.02 35.56,32.38 35.56,17.02 36.58,16 57.15,16 58.02,15.14 MJYUN-WIFI-MOD.P$21 | v18.67,41.94 18.62,41.88 14.99,41.88 14.58,42.29 v14.58,42.49
U0TX  (via drill 0.3)
  Top 0.203: MJYUN-WIFI-MOD.P$22 MJYUN-WIFI-MOD.P$122
  Top 0.254: v62.23,45.72 61.59,46.35 19.61,46.35 17.37,44.12 16.15,44.12 15.47,43.43 15.47,42.22 15.24,41.99 IC2.25 | v38.73,44.45 39.37,45.09 48.26,45.09 49.12,44.22 59.84,44.22 60.25,43.81 v60.33,43.81
  Bottom 0.254: JP2.2 61.59,50.16 61.59,48.9 62.87,47.62 62.87,46.35 v62.23,45.72 v60.33,43.81 | v38.73,44.45 38.1,43.81 38.1,42.55 36.83,41.27 36.83,32.77 36.2,32.13 36.2,17.4 36.96,16.64 57.53,16.64 58.67,15.49 58.67,12.32 60.02,10.98 MJYUN-WIFI-MOD.P$22
USBVCC  (via drill 0.5, 0.6)
  Top 0.254: JP1.VBUS1 4.25,39.42
  Top 0.305: IC2.8 13.34,35.2 | C13.2 C8.2 13.34,34.23 13.34,34.92
  Top 0.406: 4.25,39.42 7.62,39.42 8.1,39.9 v8.1,40.23 | v17.78,24.77 18.54,24.01 D5.2 | v12.7,34.92 13.34,34.92 13.34,35.2
  Bottom 0.406: v17.78,24.77 17.78,34.29 17.14,34.92 v12.7,34.92 8.89,34.92 8.1,35.71 v8.1,40.23
VIN  (via drill 0.6, 0.61)
  Top 0.406: v19.68,20.95 20.84,22.11 D5.1
  Top 0.813: IC1.3 19.68,19.53 v19.68,20.95 | D4.C 17.48,10.16 20.32,10.16 | 20.32,10.16 21.46,9.02 C10.1 23.5,10.29 23.5,10.79 v24.13,11.43 | v19.68,11.43 20.32,10.79 20.32,10.16
  Bottom 0.813: v24.13,11.43 29.84,11.43 35.56,5.71 43.81,5.71 45.72,3.81 JP5.1 | v19.68,20.95 v19.68,11.43

### Text on the board
tPlace: GND | GND | 13 | 12 | 11 | 10 | 9 | 8 | 7 | 6 | 5 | 4 | 3 | 2 | 1 | 0 | RST | SCL | SDA | x | x | SCK | x | MI | x | MO | x | x | TX | RX | [x = Restricted] | DTR | RTS | GND | RI | DCD | DSR | 3V3 | CTS | ESP | PWR | noduino.org | RST | 3V3 | 3V3 | GND | GND | VIN | A0 | NC | SDD3 | SDD2 | CS0 | EN
bPlace: GPIO6/SD_CLK | GPIO7/SD_D0 | GPIO8/SD_D1 | GPIO0/SPI_CS2 | GPIO5 | GPIO4 | GPIO16 | GPIO14/HSPI_CLK | GPIO12/HSPI_MISO | GPIO13/HSPI_MOSI | GPIO15/HSPI_CS/I2SO_BCK | GPIO2/U1TX/I2SO_WS | GPIO1/SPI_CS1 | GPIO3/I2SO_DATA | GPIO10/SPIWP | GPIO9/SPIHD | SPI_CS0 | CHIP_EN | TOUT | AUTHOR: JACK TAN V2.4